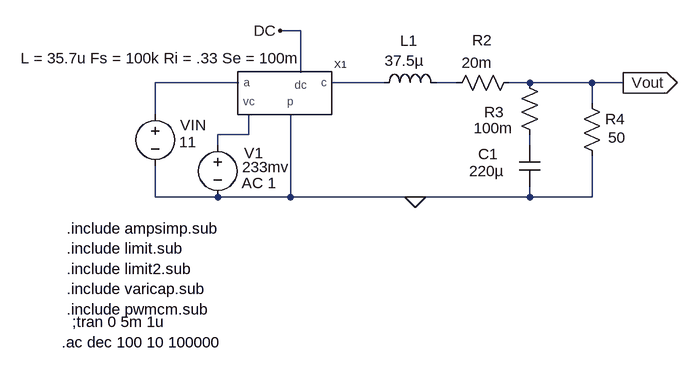
[diagram p0: schematic cm_dcm_chris_with_dcbais.asc]
cm_dcm_chris_with_dcbais.asc, the LTspice schematic file:
Version 4
SHEET 1 940 708
WIRE -1536 -1600 -1568 -1600
WIRE -1536 -1536 -1536 -1600
WIRE -1632 -1520 -1760 -1520
WIRE -1408 -1520 -1488 -1520
WIRE -1296 -1520 -1328 -1520
WIRE -1184 -1520 -1216 -1520
WIRE -1088 -1520 -1184 -1520
WIRE -1040 -1520 -1088 -1520
WIRE -1088 -1488 -1088 -1520
WIRE -1760 -1472 -1760 -1520
WIRE -1616 -1440 -1616 -1472
WIRE -1616 -1440 -1664 -1440
WIRE -1664 -1424 -1664 -1440
WIRE -1184 -1424 -1184 -1440
WIRE -1760 -1344 -1760 -1392
WIRE -1664 -1344 -1760 -1344
WIRE -1552 -1344 -1552 -1472
WIRE -1552 -1344 -1664 -1344
WIRE -1360 -1344 -1552 -1344
WIRE -1184 -1344 -1184 -1360
WIRE -1184 -1344 -1360 -1344
WIRE -1088 -1344 -1088 -1408
WIRE -1088 -1344 -1184 -1344
FLAG -1568 -1600 DC
FLAG -1360 -1344 0
FLAG -1040 -1520 Vout
IOPIN -1040 -1520 Out
SYMBOL Misc\\PWMCM -1584 -1488 R0
WINDOW 39 -383 -70 Left 0
SYMATTR SpiceLine L = 35.7u Fs = 100k Ri = .33 Se = 100m
SYMATTR InstName X1
SYMATTR Prefix X
SYMATTR Value PWMCM
SYMBOL voltage -1760 -1488 R0
WINDOW 0 38 33 Left 0
WINDOW 3 37 59 Left 0
WINDOW 123 0 0 Left 0
WINDOW 39 0 0 Left 0
SYMATTR InstName VIN
SYMATTR Value 11
SYMBOL ind -1424 -1504 R270
WINDOW 0 65 54 VTop 0
WINDOW 3 66 47 VBottom 0
SYMATTR InstName L1
SYMATTR Value 37.5µ
SYMBOL res -1312 -1504 R270
WINDOW 0 66 55 VTop 0
WINDOW 3 63 47 VBottom 0
SYMATTR InstName R2
SYMATTR Value 20m
SYMBOL res -1200 -1536 R0
WINDOW 0 -54 61 Left 0
WINDOW 3 -70 86 Left 0
SYMATTR InstName R3
SYMATTR Value 100m
SYMBOL cap -1200 -1424 R0
WINDOW 0 -63 14 Left 0
WINDOW 3 -77 40 Left 0
SYMATTR InstName C1
SYMATTR Value 220µ
SYMBOL res -1104 -1504 R0
WINDOW 3 41 68 Left 0
SYMATTR Value 50
SYMATTR InstName R4
SYMBOL voltage -1664 -1440 R0
WINDOW 0 41 28 Left 0
WINDOW 3 38 50 Left 0
WINDOW 123 37 74 Left 0
WINDOW 39 0 0 Left 0
SYMATTR InstName V1
SYMATTR Value 233mv
SYMATTR Value2 AC 1
TEXT -1896 -1296 Left 0 !.include ampsimp.sub\n.include limit.sub\n.include limit2.sub\n.include varicap.sub\n.include pwmcm.sub
TEXT -1904 -1120 Left 0 !.ac dec 100 10 100000
TEXT -1888 -1152 Left 0 !;tran 0 5m 1u

The netlist it stands for:
* cm_dcm_chris_with_dcbais.asc
XX1 N001 N002 0 N004 DC PWMCM L = 35.7u Fs = 100k Ri = .33 Se = 100m  ; pins a c p vc dc
VIN N001 0 11
L1 N002 N003 37.5µ
R2 N003 Vout 20m
R3 Vout N005 100m
C1 N005 0 220µ
R4 Vout 0 50
V1 N004 0 233mv AC 1
.include ampsimp.sub
.include limit.sub
.include limit2.sub
.include varicap.sub
.include pwmcm.sub
.ac dec 100 10 100000
;tran 0 5m 1u
.backanno
.end